# EAGLE design coinflip (EAGLE 9.6.2)
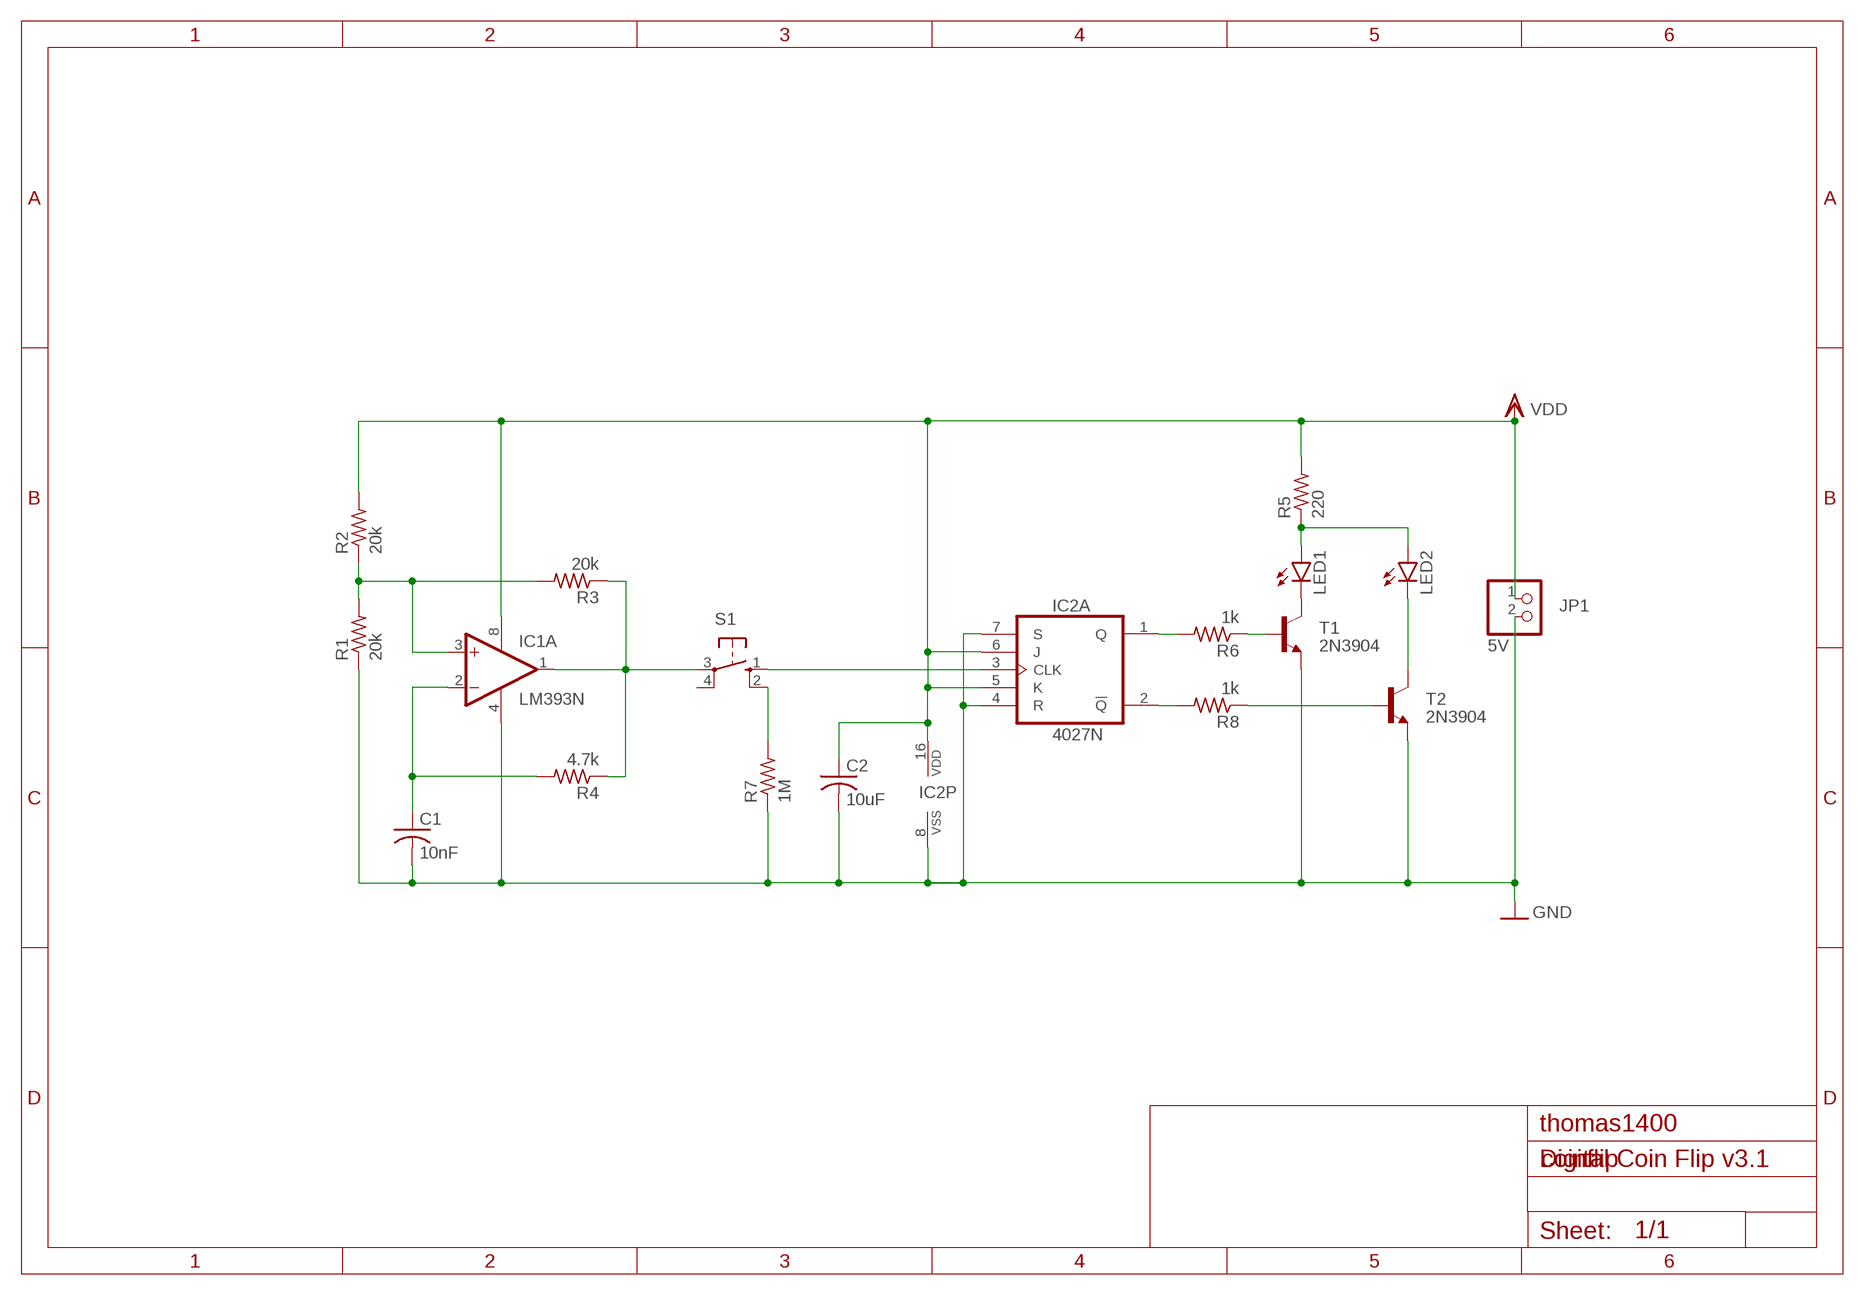
[diagram p0: schematic, sheet 1]

## Parts
C1  10nF  C-US050-024X044  [C050-024X044]
C2  10uF  C-US050-024X044  [C050-024X044]
IC1  LM393N  [DIL08]
IC2  4027N  [DIL16]
JP1  5V  PINHD-1X2  [1X02]
LED1  LED3MM  [LED3MM]
LED2  LED3MM  [LED3MM]
R1  20k  R-US_0207/10  [0207/10]
R2  20k  R-US_0207/10  [0207/10]
R3  20k  R-US_0207/10  [0207/10]
R4  4.7k  R-US_0207/10  [0207/10]
R5  220  R-US_0207/10  [0207/10]
R6  1k  R-US_0207/10  [0207/10]
R7  1M  R-US_0207/10  [0207/10]
R8  1k  R-US_0207/10  [0207/10]
S1  10-XX  [B3F-10XX]
T1  2N3904  [TO92]
T2  2N3904  [TO92]

## Nets
GND: C1.2 C2.2 IC1.4(P:V-) IC2.4(A:R) IC2.7(A:S) IC2.8(P:VSS) JP1.2 R1.1 R7.1 T1.3(E) T2.3(E)
N$1: IC1.1(A:OUT) R3.1 R4.1 S1.3(P)
N$2: IC1.3(A:+IN) R1.2 R2.1 R3.2
N$3: C1.1 IC1.2(A:-IN) R4.2
N$4: IC2.1(A:Q) R6.2
N$5: R7.2 S1.2(S1)
N$6: R6.1 T1.2(B)
N$7: IC2.2(A:!Q) R8.2
N$8: R8.1 T2.2(B)
N$9: LED1.K(C) T1.1(C)
N$10: LED1.A LED2.A R5.1
N$13: IC2.3(A:CLK) S1.1(S)
N$14: LED2.K(C) T2.1(C)
VDD: C2.1 IC1.8(P:V+) IC2.5(A:K) IC2.6(A:J) IC2.16(P:VDD) JP1.1 R2.2 R5.2
Unconnected: IC1.5(B:+IN) IC1.6(B:-IN) IC1.7(B:OUT) IC2.9(B:S) IC2.10(B:J) IC2.11(B:K) IC2.12(B:R) IC2.13(B:CLK) IC2.14(B:!Q) IC2.15(B:Q) S1.4(P1)

## Notes on the sheet
- thomas1400
- Digital Coin Flip v3.1

## Library data of the parts
C1 C2 = resistor_nofill:C-US: CAPACITOR, American symbol
IC1 = linear:LM393: COMPARATOR
IC2 = 40xx:4027: Dual JK FLIP FLOP
JP1 = pinhead:PINHD-1X2: PIN HEADER
LED1 LED2 = led_nofill:LED: LED OSRAM: - CHIPLED LG R971, LG N971, LY N971, LG Q971, LY Q971, LO R971, LY R971 LH N974, LH R974 LS Q976, LO Q976, LY Q976 LO Q996 - Hyper CHIPLED LW Q18S LB Q993, LB Q99A, LB R99A - SideLED LS A670, LO A670, LY A670, LG A670, LP A670 LB A673, LV A673, LT A673, LW A673 LH A674 LY A675 LS A676, LA A676, LO A676, LY A676, LW A676 LS A679, LY A679, LG A679 - Hyper Micro SIDELED® LS Y876, LA Y876, LO Y876, LY Y876 LT Y87S - SmartLED LW L88C, LW L88S LB L89C, LB L89S, LG L890 LS L89K, LO L89K, LY L89K LS L896, LA L896, LO L896, LY L896 - TOPLED LS T670, LO T670, LY T670, LG T670, LP T670 LSG T670, LSP T670, LSY T670, LOP T670, LYG T670 LG T671, LOG T671, LSG T671 LB T673, LV T673, LT T673, LW T673 LH T674 LS T676, LA T676, LO T676, LY T676, LB T676, LH T676, LSB T676, LW T676 LB T67C, LV T67C, LT T67C, LS T67K, LO T67K, LY T67K, LW E67C LS E67B, LA E67B, LO E67B, LY E67B, LB E67C, LV E67C, LT E67C LW T67C LS T679, LY T679, LG T679 LS T770, LO T770, LY T770, LG T770, LP T770 LB T773, LV T773, LT T773, LW T773 LH T774 LS E675, LA E675, LY E675, LS T675 LS T776, LA T776, LO T776, LY T776, LB T776 LHGB T686 LT T68C, LB T68C - Hyper Mini TOPLED® LB M676 - Mini TOPLED Santana® LG M470 LS M47K, LO M47K, LY M47K Source: http://www.osram.convergy.de LUXEON: - LUMILED® LXK2-PW12-R00, LXK2-PW12-S00, LXK2-PW14-U00, LXK2-PW14-V00 LXK2-PM12-R00, LXK2-PM12-S00, LXK2-PM14-U00 LXK2-PE12-Q00, LXK2-PE12-R00, LXK2-PE12-S00, LXK2-PE14-T00, LXK2-PE14-U00 LXK2-PB12-K00, LXK2-PB12-L00, LXK2-PB12-M00, LXK2-PB14-N00, LXK2-PB14-P00, LXK2-PB14-Q00 LXK2-PR12-L00, LXK2-PR12-M00, LXK2-PR14-Q00, LXK2-PR14-R00 LXK2-PD12-Q00, LXK2-PD12-R00, LXK2-PD12-S00 LXK2-PH12-R00, LXK2-PH12-S00 LXK2-PL12-P00, LXK2-PL12-Q00, LXK2-PL12-R00 Source: www.luxeon.com KINGBRIGHT: KA-3528ASYC Source: www.kingbright.com
R1-R8 = resistor:R-US_: RESISTOR, American symbol
S1 = switch-omron:10-XX: OMRON SWITCH; MPN: B3F-1000; OC_FARNELL: 176432; OC_NEWARK: 36M3542
T1 T2 = transistor:2N3904: NPN TRANSISTOR

## Board
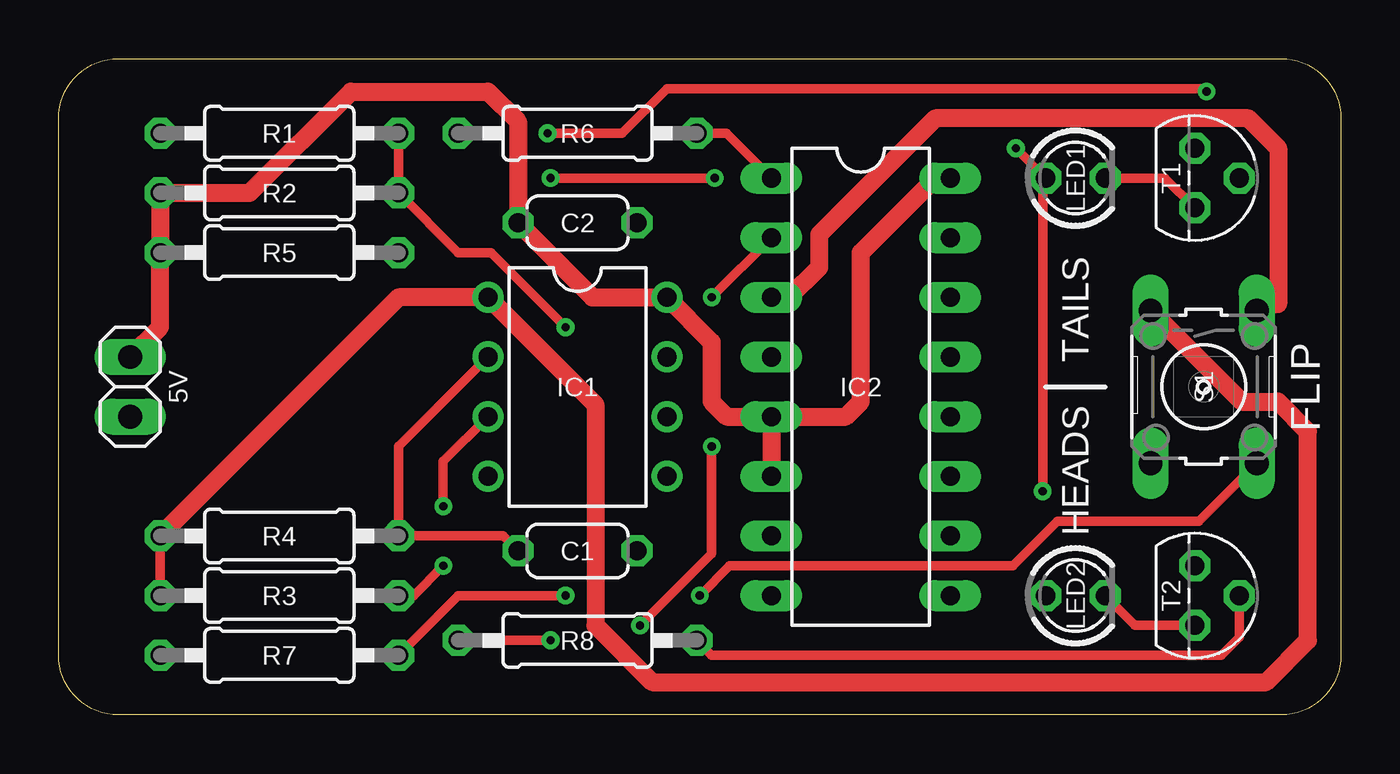
[diagram p1: board, top side]
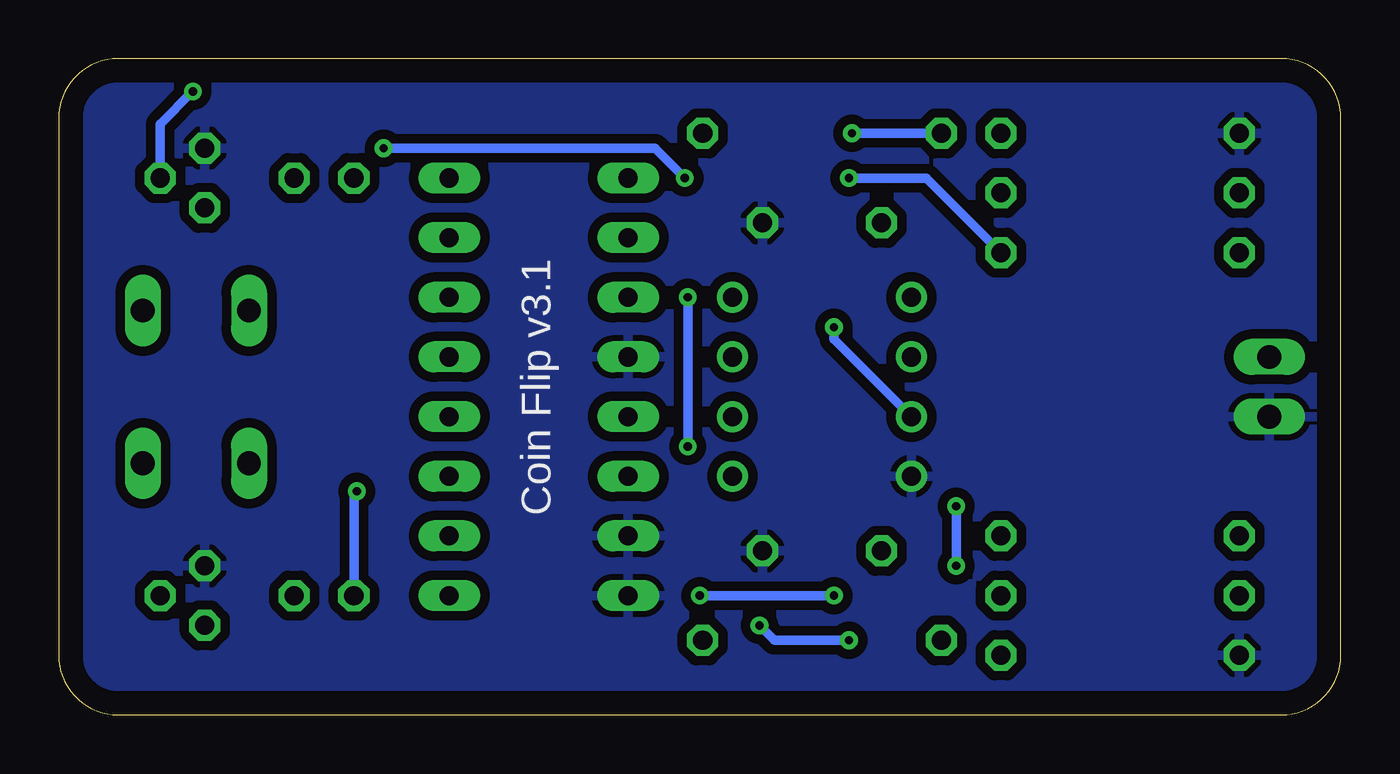
[diagram p2: board, bottom side, seen from below]

Size 54.61 x 27.94 mm. Coordinates in mm from the lower left corner, seen from the top.
Outline: 52.07,0 2.54,0 arc-90 0,2.54 0,25.4 arc-90 2.54,27.94 52.07,27.94 arc-90 54.61,25.4 54.61,2.54 arc-90 52.07,0
Copper layers (1*16): Top 0.035mm / dielectric 1.5mm / Bottom 0.035mm
Design rules "default": minimum track width 6mil, minimum drill 0.35mm, track to track 6mil, track to pad 6mil, pad to pad 6mil, via to via 6mil, smd to smd 6mil, copper to edge 40mil, drill to drill 6mil, minimum pad ring 10mil, minimum via ring 8mil, stop-mask expansion 4mil, vias tented up to drill 0mil, thermal gap 10mil

### Footprints (pad centres in the part's own frame; a part is rotated, then mirrored left to right if it is on the bottom)
C050-024X044 = drill 0.813 octagon: 1 -2.54,0; 2 2.54,0
DIL08 = drill 0.813 pad 1.27: 1 -3.81,-3.81; 2 -1.27,-3.81; 3 1.27,-3.81; 4 3.81,-3.81; 5 3.81,3.81; 6 1.27,3.81; 7 -1.27,3.81; 8 -3.81,3.81
DIL16 = drill 0.813 long: 1 -8.89,-3.81; 2 -6.35,-3.81; 3 -3.81,-3.81; 4 -1.27,-3.81; 5 1.27,-3.81; 6 3.81,-3.81; 7 6.35,-3.81; 8 8.89,-3.81; 9 8.89,3.81; 10 6.35,3.81; 11 3.81,3.81; 12 1.27,3.81; 13 -1.27,3.81; 14 -3.81,3.81; 15 -6.35,3.81; 16 -8.89,3.81
1X02 = drill 1.016 long: 1 -1.27,0; 2 1.27,0
LED3MM = drill 0.813 octagon: A -1.27,0; K 1.27,0
0207/10 = drill 0.813 octagon: 1 -5.08,0; 2 5.08,0
B3F-10XX = drill 1.016 long: 1 -3.251,2.261; 2 3.251,2.261; 3 -3.251,-2.261; 4 3.251,-2.261
TO92 = drill 0.813 octagon: 1 1.27,0; 2 0,1.905; 3 -1.27,0

### Placement (x,y rotation side)
C1  22.1,6.99 0 top
C2  22.1,20.95 0 top
IC1  22.1,13.97 270 top
IC2  34.16,13.97 270 top
JP1  3.05,13.97 270 top
LED1  43.31,22.86 0 top
LED2  43.31,5.08 0 top
R1  9.4,24.77 0 top
R2  9.4,22.23 180 top
R3  9.4,5.08 0 top
R4  9.4,7.62 0 top
R5  9.4,19.68 180 top
R6  22.1,24.77 0 top
R7  9.4,2.54 0 top
R8  22.1,3.17 180 top
S1  48.77,13.97 270 top
T1  48.39,22.86 270 top
T2  48.39,5.08 270 top

### Tracks (layer width: path | path; a pad name or v marks a point on that pad's centre or on a via)
GND
  pour Bottom (isolate 0.406): 0.51,27.3 53.85,27.3 53.85,0.64 0.51,0.64
N$1
  Top 0.406: R4.1 R3.1
  Top 0.762: R4.1 14.48,17.78 IC1.1 22.86,13.21 22.86,3.81 25.27,1.4 51.44,1.4 53.21,3.17 53.21,12.06 51.94,13.34 50.39,13.34 S1.3
N$2  (via drill 0.35)
  Top 0.406: R1.2 R2.1 17.02,19.68 18.41,19.68 v21.59,16.51 | R3.2 15.11,5.08 v16.38,6.35 | v16.38,8.89 16.38,10.79 IC1.3
  Bottom 0.406: v16.38,6.35 v16.38,8.89 | v21.59,16.51 21.59,16 IC1.3
N$3
  Top 0.406: IC1.2 14.48,11.43 R4.2 18.92,7.62 C1.1
N$4
  Top 0.406: R6.2 28.45,24.77 IC2.1
N$5  (via drill 0.35)
  Top 0.406: R7.2 17.02,5.08 v21.59,5.08 | v27.3,5.08 28.57,6.35 40.64,6.35 42.55,8.26 48.56,8.26 S1.2
  Bottom 0.406: v21.59,5.08 v27.3,5.08
N$6  (via drill 0.35)
  Top 0.406: v20.83,24.77 24,24.77 25.91,26.67 48.9,26.67 v48.9,26.55
  Bottom 0.406: v20.83,24.77 R6.1 | v48.9,26.55 50.29,25.15 T1.2
N$7  (via drill 0.35)
  Top 0.406: v27.81,11.43 27.81,6.86 v24.77,3.81 | v27.81,17.78 IC2.2 | R8.2 v20.95,3.17
  Bottom 0.406: v27.81,11.43 v27.81,17.78 | v20.95,3.17 24.13,3.17 v24.77,3.81
N$8
  Top 0.406: R8.1 27.81,2.54 49.53,2.54 50.29,3.3 T2.2
N$9
  Top 0.406: LED1.K 47.12,22.86 T1.1
N$10  (via drill 0.35)
  Top 0.406: v20.95,22.86 v27.94,22.86 | v41.91,9.53 41.91,22.73 LED1.A v40.77,24.13
  Bottom 0.406: R5.1 17.65,22.86 v20.95,22.86 | v27.94,22.86 29.21,24.13 v40.77,24.13 | LED2.A 42.04,9.53 v41.91,9.53
N$13
  Top 0.762: S1.1 51.94,17.5 51.94,24.13 50.67,25.4 37.34,25.4 32.38,20.45 32.38,19.05 31.11,17.78 IC2.3
N$14
  Top 0.406: LED2.K 45.85,3.81 T2.1
VDD
  Top 0.762: IC2.5 28.45,12.7 27.81,13.34 27.81,15.88 IC1.8 22.73,17.78 C2.1 19.56,25.27 18.29,26.54 12.45,26.54 8.13,22.23 R2.2 R5.2 4.32,16.51 JP1.1 | IC2.5 IC2.6 | IC2.5 33.53,12.7 34.16,13.34 34.16,19.68 37.34,22.86 IC2.16

### Text on the board
tPlace: TAILS | FLIP | HEADS
bPlace: Coin Flip v3.1
tNames: 5V